# EAGLE design ESC_holder (EAGLE 7.2.0)
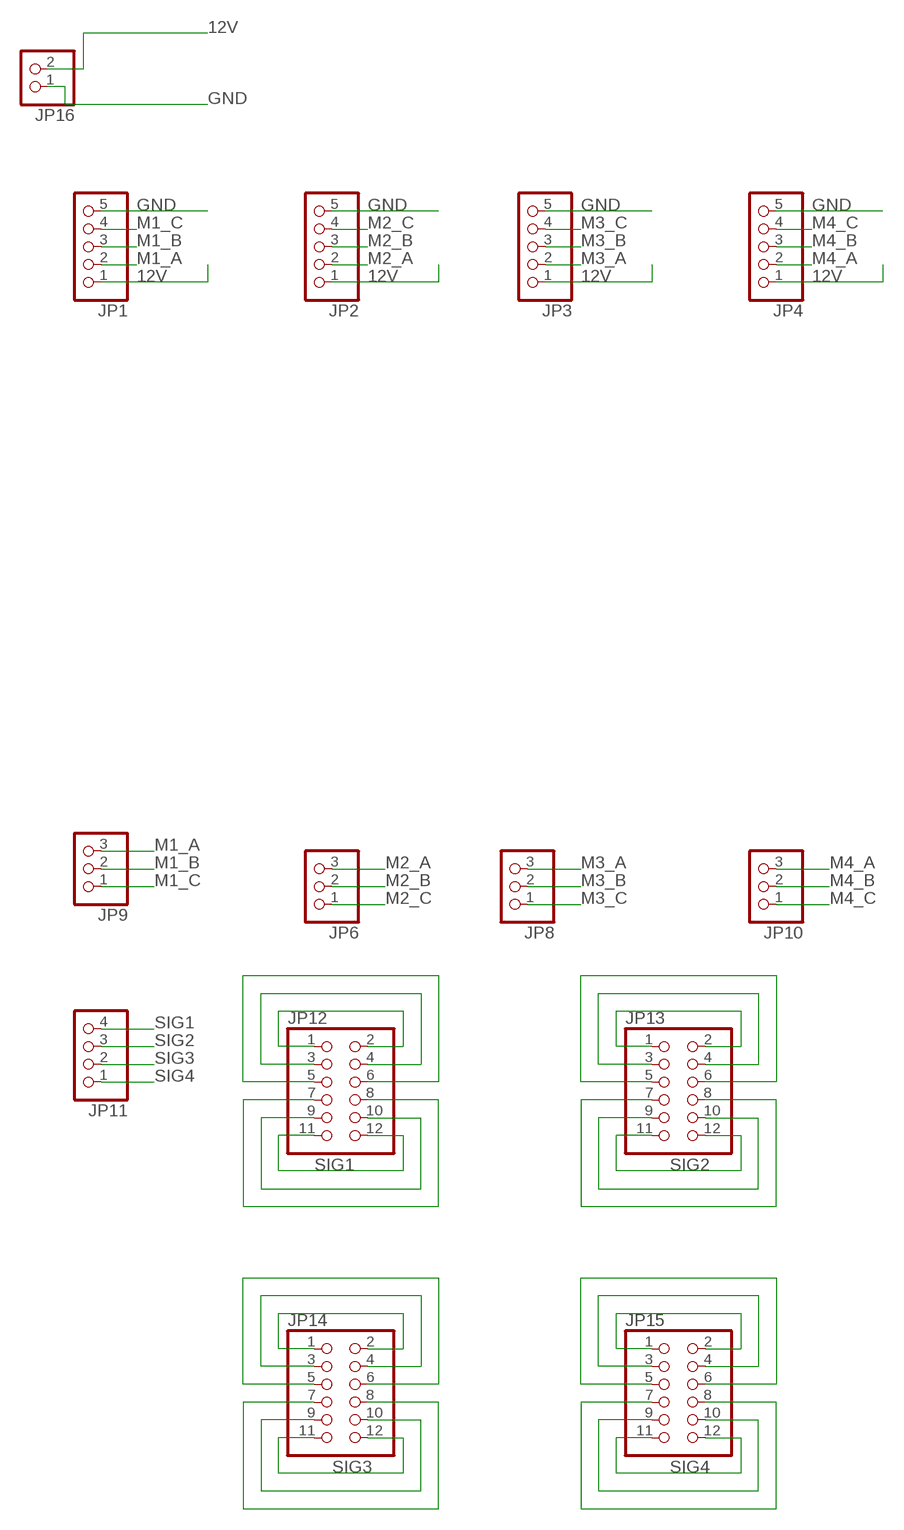
[diagram p0: schematic, sheet 1]

## Parts
JP1  PINHD-1X5  [1X05]
JP2  PINHD-1X5  [1X05]
JP3  PINHD-1X5  [1X05]
JP4  PINHD-1X5  [1X05]
JP6  PINHD-1X3  [1X03]
JP8  PINHD-1X3  [1X03]
JP9  PINHD-1X3  [1X03]
JP10  PINHD-1X3  [1X03]
JP11  PINHD-1X4  [1X04]
JP12  PINHD-2X6  [2X06]
JP13  PINHD-2X6  [2X06]
JP14  PINHD-2X6  [2X06]
JP15  PINHD-2X6  [2X06]
JP16  PINHD-1X2  [1X02]

## Nets
12V: JP1.1 JP2.1 JP3.1 JP4.1 JP16.2
GND: JP1.5 JP2.5 JP3.5 JP4.5 JP16.1
M1_A: JP1.2 JP9.3
M1_B: JP1.3 JP9.2
M1_BLACK: JP12.1 JP12.2
M1_BLACK1: JP13.1 JP13.2
M1_BLACK2: JP14.1 JP14.2
M1_BLACK3: JP15.1 JP15.2
M1_C: JP1.4 JP9.1
M2_A: JP2.2 JP6.3
M2_B: JP2.3 JP6.2
M2_C: JP2.4 JP6.1
M3_A: JP3.2 JP8.3
M3_B: JP3.3 JP8.2
M3_C: JP3.4 JP8.1
M4_A: JP4.2 JP10.3
M4_B: JP4.3 JP10.2
M4_C: JP4.4 JP10.1
N$1: JP13.3 JP13.4
N$2: JP12.3 JP12.4
N$3: JP12.5 JP12.6
N$4: JP12.7 JP12.8
N$5: JP12.9 JP12.10
N$6: JP13.5 JP13.6
N$7: JP13.7 JP13.8
N$8: JP13.9 JP13.10
N$9: JP14.3 JP14.4
N$10: JP14.5 JP14.6
N$11: JP14.7 JP14.8
N$12: JP14.9 JP14.10
N$13: JP15.3 JP15.4
N$14: JP15.5 JP15.6
N$15: JP15.7 JP15.8
N$16: JP15.9 JP15.10
SIG1: JP11.4 JP12.11 JP12.12
SIG2: JP11.3 JP13.11 JP13.12
SIG3: JP11.2 JP14.11 JP14.12
SIG4: JP11.1 JP15.11 JP15.12

## Library data of the parts
JP1-JP4 = pinhead:PINHD-1X5: PIN HEADER
JP6 JP8-JP10 = pinhead:PINHD-1X3: PIN HEADER
JP11 = pinhead:PINHD-1X4: PIN HEADER
JP12-JP15 = pinhead:PINHD-2X6: PIN HEADER
JP16 = pinhead:PINHD-1X2: PIN HEADER

## Board
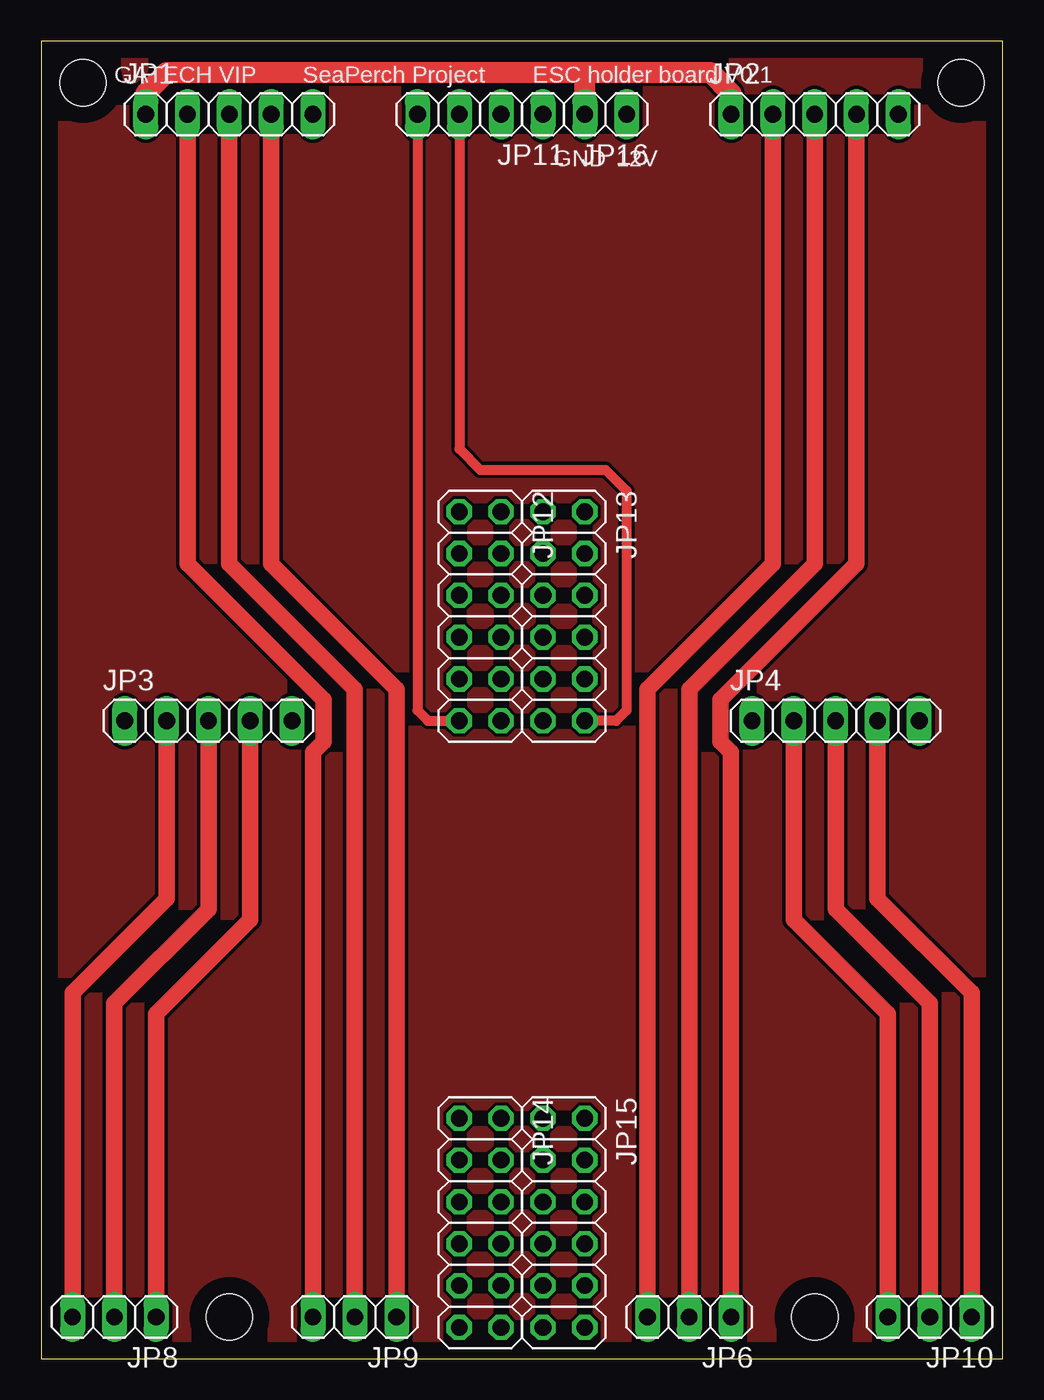
[diagram p1: board, top side]
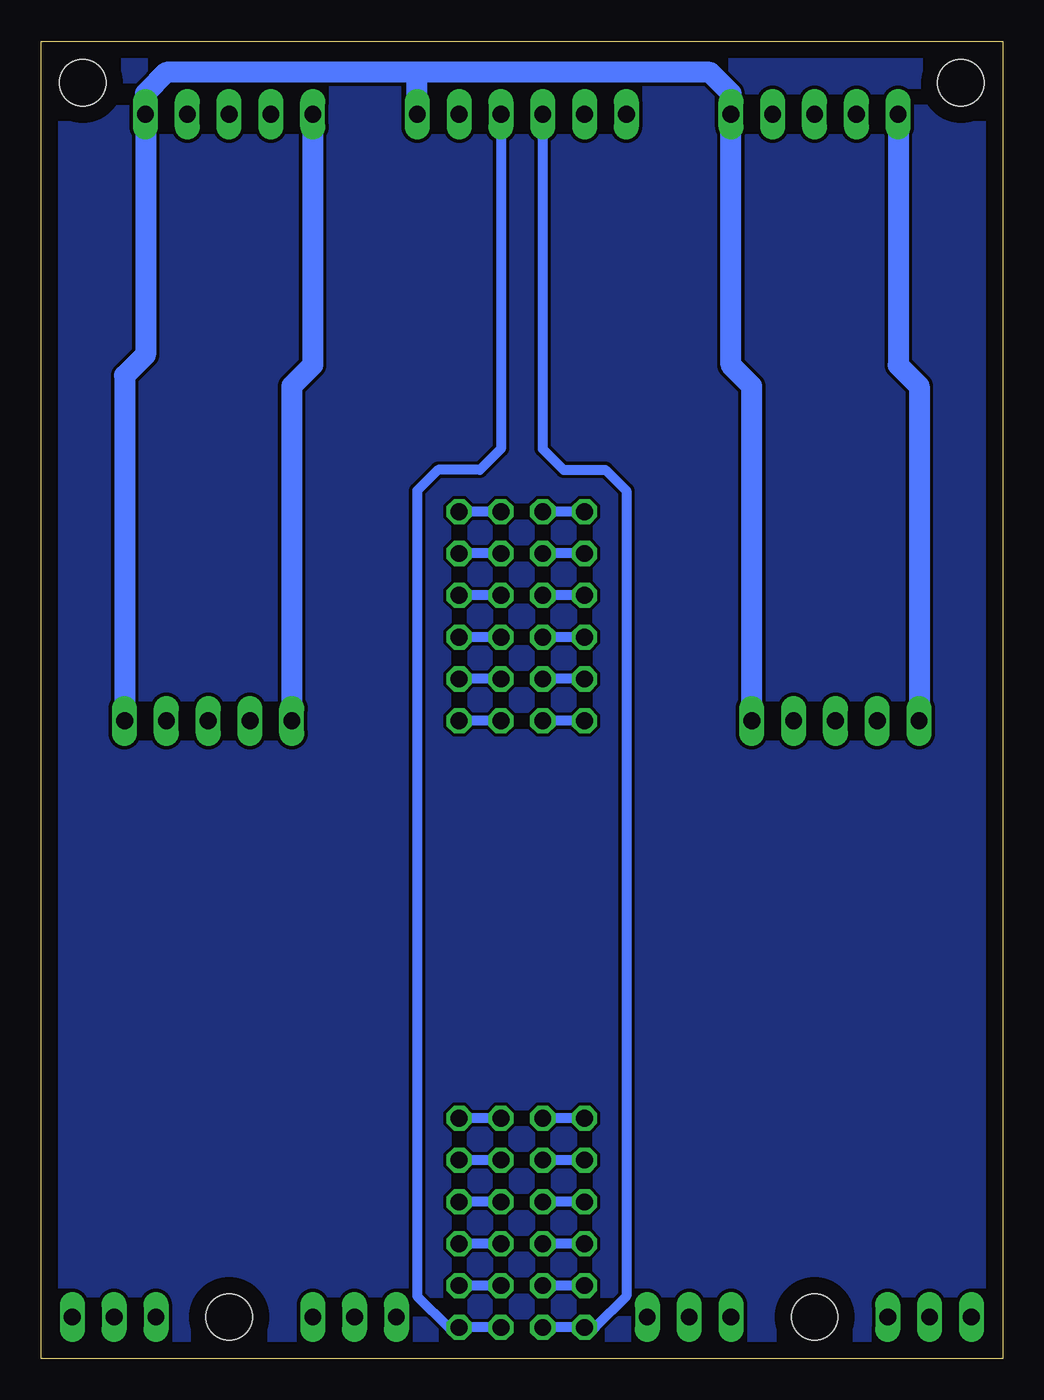
[diagram p2: board, bottom side, seen from below]

Size 58.41 x 80 mm. Coordinates in mm from the lower left corner, seen from the top.
Outline: 0,0 58.41,0 58.41,80 0,80 0,0
Copper layers (1*16): Top 0.035mm / dielectric 1.5mm / Bottom 0.035mm
Design rules "default": minimum track width 10mil, minimum drill 24mil, track to track 8mil, track to pad 8mil, pad to pad 8mil, via to via 8mil, smd to smd 8mil, copper to edge 40mil, drill to drill 8mil, minimum pad ring 10mil, minimum via ring 8mil, stop-mask expansion 4mil, vias tented up to drill 0mil, thermal gap 10mil
Holes 2.8 mm at 2.54,77.47 11.43,2.54 46.99,2.54 55.88,77.47

### Footprints (pad centres in the part's own frame; a part is rotated, then mirrored left to right if it is on the bottom)
1X05 = drill 1.016 long: 1 -5.08,0; 2 -2.54,0; 3 0,0; 4 2.54,0; 5 5.08,0
1X03 = drill 1.016 long: 1 -2.54,0; 2 0,0; 3 2.54,0
1X04 = drill 1.016 long: 1 -3.81,0; 2 -1.27,0; 3 1.27,0; 4 3.81,0
2X06 = drill 1.016 octagon: 1 -6.35,-1.27; 2 -6.35,1.27; 3 -3.81,-1.27; 4 -3.81,1.27; 5 -1.27,-1.27; 6 -1.27,1.27; 7 1.27,-1.27; 8 1.27,1.27; 9 3.81,-1.27; 10 3.81,1.27; 11 6.35,-1.27; 12 6.35,1.27
1X02 = drill 1.016 long: 1 -1.27,0; 2 1.27,0

### Placement (x,y rotation side)
JP1  11.43,75.57 0 top
JP2  46.99,75.57 0 top
JP3  10.16,38.73 0 top
JP4  48.26,38.73 0 top
JP6  39.37,2.54 180 top
JP8  4.45,2.54 180 top
JP9  19.05,2.54 180 top
JP10  53.98,2.54 180 top
JP11  26.67,75.57 180 top
JP12  26.67,45.09 270 top
JP13  31.75,45.09 270 top
JP14  26.67,8.26 270 top
JP15  31.75,8.26 270 top
JP16  34.29,75.57 180 top

### Tracks (layer width: path | path; a pad name or v marks a point on that pad's centre or on a via)
12V
  Top 1.27: JP1.1 6.35,76.84 7.62,78.11 33.02,78.11 | 33.02,78.11 40.64,78.11 41.91,76.84 JP2.1 | JP16.2 33.02,78.11
  Bottom 1.27: JP1.1 6.35,60.32 5.08,59.05 JP3.1 | JP2.1 41.91,60.32 43.18,59.05 JP4.1
GND
  Bottom 1.27: JP4.5 53.34,59.69 52.07,60.96 JP2.5 52.07,76.84 50.8,78.11 35.56,78.11 | JP3.5 15.24,59.05 16.51,60.32 JP1.5 16.51,76.84 17.78,78.11 35.56,78.11 | JP16.1 35.56,78.11
M1_A
  Top 1.016: JP9.3 16.51,6.35 16.51,6.98 16.51,36.83 17.14,37.46 17.14,40 8.89,48.26 JP1.2
M1_B
  Top 1.016: JP9.2 19.05,40.64 11.43,48.26 JP1.3
M1_BLACK
  Bottom 0.61: JP12.1 JP12.2
M1_BLACK1
  Bottom 0.61: JP13.1 JP13.2
M1_BLACK2
  Bottom 0.61: JP14.1 JP14.2
M1_BLACK3
  Bottom 0.61: JP15.1 JP15.2
M1_C
  Top 1.016: JP9.1 21.59,40.64 13.97,48.26 JP1.4
M2_A
  Top 1.016: JP2.2 44.45,48.26 36.83,40.64 JP6.3
M2_B
  Top 1.016: JP2.3 46.99,48.26 39.37,40.64 JP6.2
M2_C
  Top 1.016: JP2.4 49.53,48.26 41.27,40 41.27,37.46 41.91,36.83 JP6.1
M3_A
  Top 1.016: JP3.2 7.62,27.94 1.91,22.23 JP8.3
M3_B
  Top 1.016: JP3.3 10.16,27.31 4.45,21.59 JP8.2 4.45,1.91
M3_C
  Top 1.016: JP3.4 12.7,26.67 6.99,20.96 JP8.1
M4_A
  Top 1.016: JP4.2 45.72,26.67 51.44,20.96 JP10.3
M4_B
  Top 1.016: JP4.3 48.26,27.31 53.98,21.59 JP10.2
M4_C
  Top 1.016: JP4.4 50.8,27.94 56.52,22.23 JP10.1
N$1
  Bottom 0.61: JP13.3 JP13.4
N$2
  Bottom 0.61: JP12.3 JP12.4
N$3
  Bottom 0.61: JP12.5 JP12.6
N$4
  Bottom 0.61: JP12.7 JP12.8
N$5
  Bottom 0.61: JP12.9 JP12.10
N$6
  Bottom 0.61: JP13.5 JP13.6
N$7
  Bottom 0.61: JP13.7 JP13.8
N$8
  Bottom 0.61: JP13.9 JP13.10
N$9
  Bottom 0.61: JP14.3 JP14.4
N$10
  Bottom 0.61: JP14.5 JP14.6
N$11
  Bottom 0.61: JP14.7 JP14.8
N$12
  Bottom 0.61: JP14.9 JP14.10
N$13
  Bottom 0.61: JP15.3 JP15.4
N$14
  Bottom 0.61: JP15.5 JP15.6
N$15
  Bottom 0.61: JP15.7 JP15.8
N$16
  Bottom 0.61: JP15.9 JP15.10
N$17
  pour Top: 0,80.01 58.42,80.01 58.42,0 0,0
N$18
  pour Bottom: 0,80.01 58.42,80.01 58.42,0 0,0
SIG1
  Top 0.61: JP12.11 23.5,38.73 22.86,39.37 JP11.4
  Bottom 0.61: JP12.11 JP12.12
SIG2
  Top 0.61: JP13.12 34.92,38.73 35.56,39.37 35.56,52.7 34.29,53.98 26.67,53.98 25.4,55.24 JP11.3
  Bottom 0.61: JP13.11 JP13.12
SIG3
  Bottom 0.61: JP14.12 JP14.11 24.77,1.91 22.86,3.81 22.86,52.7 24.13,53.98 26.67,53.98 27.94,55.24 JP11.2
SIG4
  Bottom 0.61: JP15.11 JP15.12 33.66,1.91 35.56,3.81 35.56,52.7 34.29,53.98 31.75,53.98 30.48,55.24 JP11.1

### Text on the board
tPlace: GATECH VIP | SeaPerch Project | ESC holder board V0.1 | GND | 12V